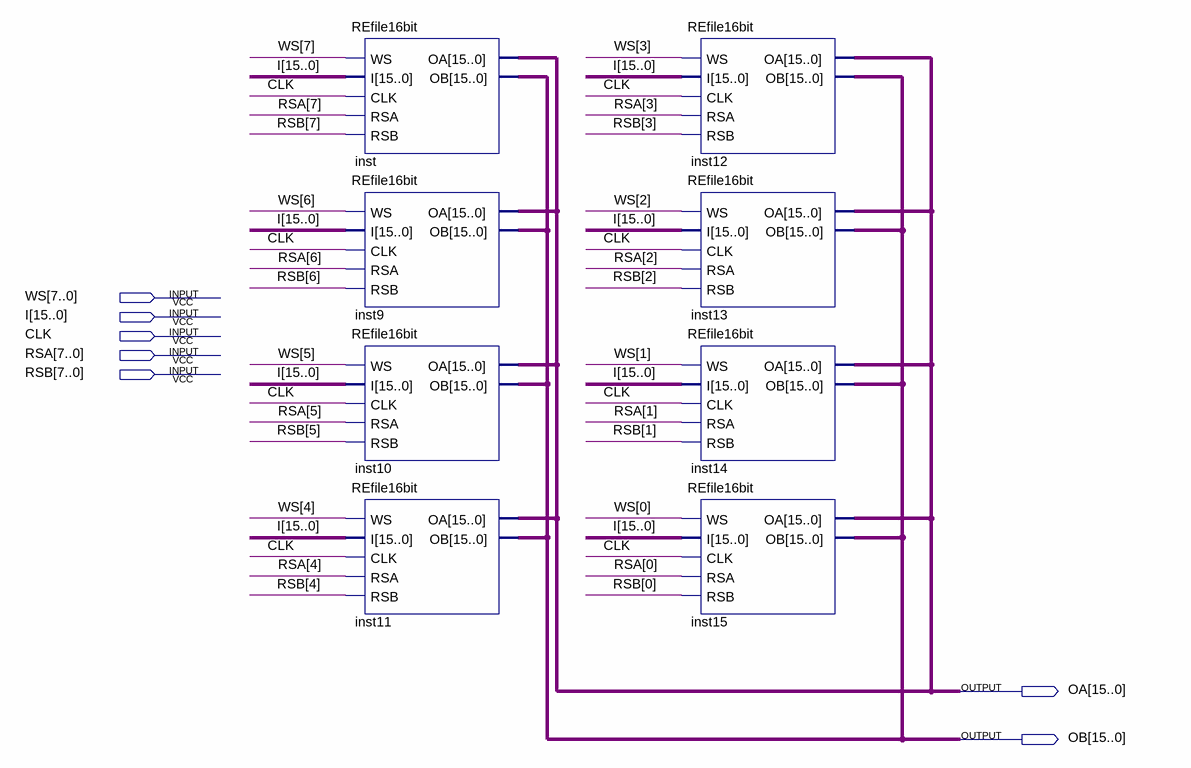
[diagram p0: schematic sheet]
// Quartus schematic RFC_8X16.bdf as structural Verilog: 8 symbols, 7 pins
module RFC_8X16 (
  input  [7:0] WS,
  input  [15:0] I,
  input  CLK,
  input  [7:0] RSA,
  input  [7:0] RSB,
  output [15:0] OA,
  output [15:0] OB
);

  REfile16bit inst (.WS(WS[7]), .I(I), .CLK(CLK), .RSA(RSA[7]), .RSB(RSB[7]), .OA(OA), .OB(OB));
  REfile16bit inst9 (.WS(WS[6]), .I(I), .CLK(CLK), .RSA(RSA[6]), .RSB(RSB[6]), .OA(OA), .OB(OB));
  REfile16bit inst10 (.WS(WS[5]), .I(I), .CLK(CLK), .RSA(RSA[5]), .RSB(RSB[5]), .OA(OA), .OB(OB));
  REfile16bit inst11 (.WS(WS[4]), .I(I), .CLK(CLK), .RSA(RSA[4]), .RSB(RSB[4]), .OA(OA), .OB(OB));
  REfile16bit inst12 (.WS(WS[3]), .I(I), .CLK(CLK), .RSA(RSA[3]), .RSB(RSB[3]), .OA(OA), .OB(OB));
  REfile16bit inst13 (.WS(WS[2]), .I(I), .CLK(CLK), .RSA(RSA[2]), .RSB(RSB[2]), .OA(OA), .OB(OB));
  REfile16bit inst14 (.WS(WS[1]), .I(I), .CLK(CLK), .RSA(RSA[1]), .RSB(RSB[1]), .OA(OA), .OB(OB));
  REfile16bit inst15 (.WS(WS[0]), .I(I), .CLK(CLK), .RSA(RSA[0]), .RSB(RSB[0]), .OA(OA), .OB(OB));
endmodule
